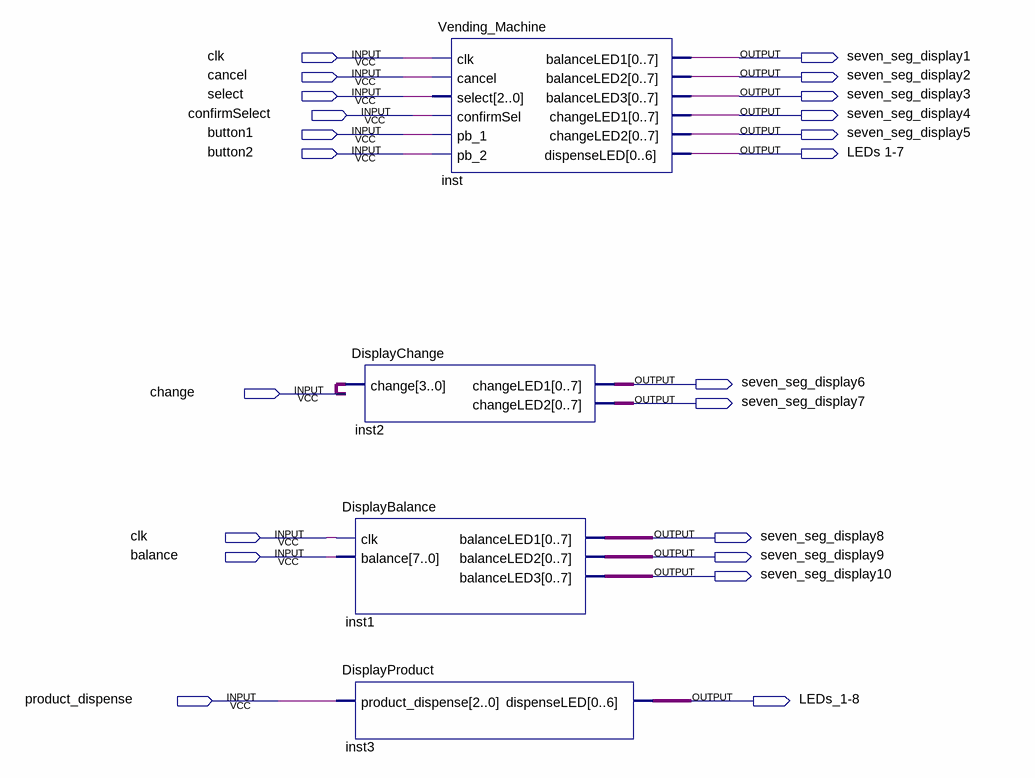
[diagram p0: schematic sheet]
// Quartus schematic blockDiagram.bdf as structural Verilog: 4 symbols, 22 pins
module blockDiagram (
  input  clk,
  input  cancel,
  input  select,
  input  confirmSelect,
  input  button1,
  input  button2,
  input  change,
  input  balance,
  input  product_dispense,
  output seven_seg_display1,
  output seven_seg_display2,
  output seven_seg_display3,
  output seven_seg_display4,
  output seven_seg_display5,
  output \LEDs_1-7 ,
  output seven_seg_display6,
  output seven_seg_display7,
  output seven_seg_display8,
  output seven_seg_display9,
  output seven_seg_display10,
  output \LEDs_1-8 
);

  wire [3:0] undriven;
  wire [6:0] inst3_dispenseled;
  wire [7:0] inst1_balanceled1, inst1_balanceled2, inst1_balanceled3, inst2_changeled1, inst2_changeled2;

  DisplayChange inst2 (.change(undriven), .changeLED1(inst2_changeled1), .changeLED2(inst2_changeled2));
  DisplayBalance inst1 (
    .clk(clk), .balance({8{balance}}), .balanceLED1(inst1_balanceled1), .balanceLED2(inst1_balanceled2),
    .balanceLED3(inst1_balanceled3));
  DisplayProduct inst3 (.product_dispense({3{product_dispense}}), .dispenseLED(inst3_dispenseled));
  Vending_Machine inst (
    .clk(clk), .cancel(cancel), .select({3{select}}), .confirmSel(confirmSelect), .pb_1(button1),
    .pb_2(button2), .balanceLED1(seven_seg_display1), .balanceLED2(seven_seg_display2),
    .balanceLED3(seven_seg_display3), .changeLED1(seven_seg_display4), .changeLED2(seven_seg_display5),
    .dispenseLED(\LEDs_1-7 ));
endmodule
